# Altium schematic sheet retro_PCLD_board-V2_2026-10-05.schdoc
size 300 x 205 mm
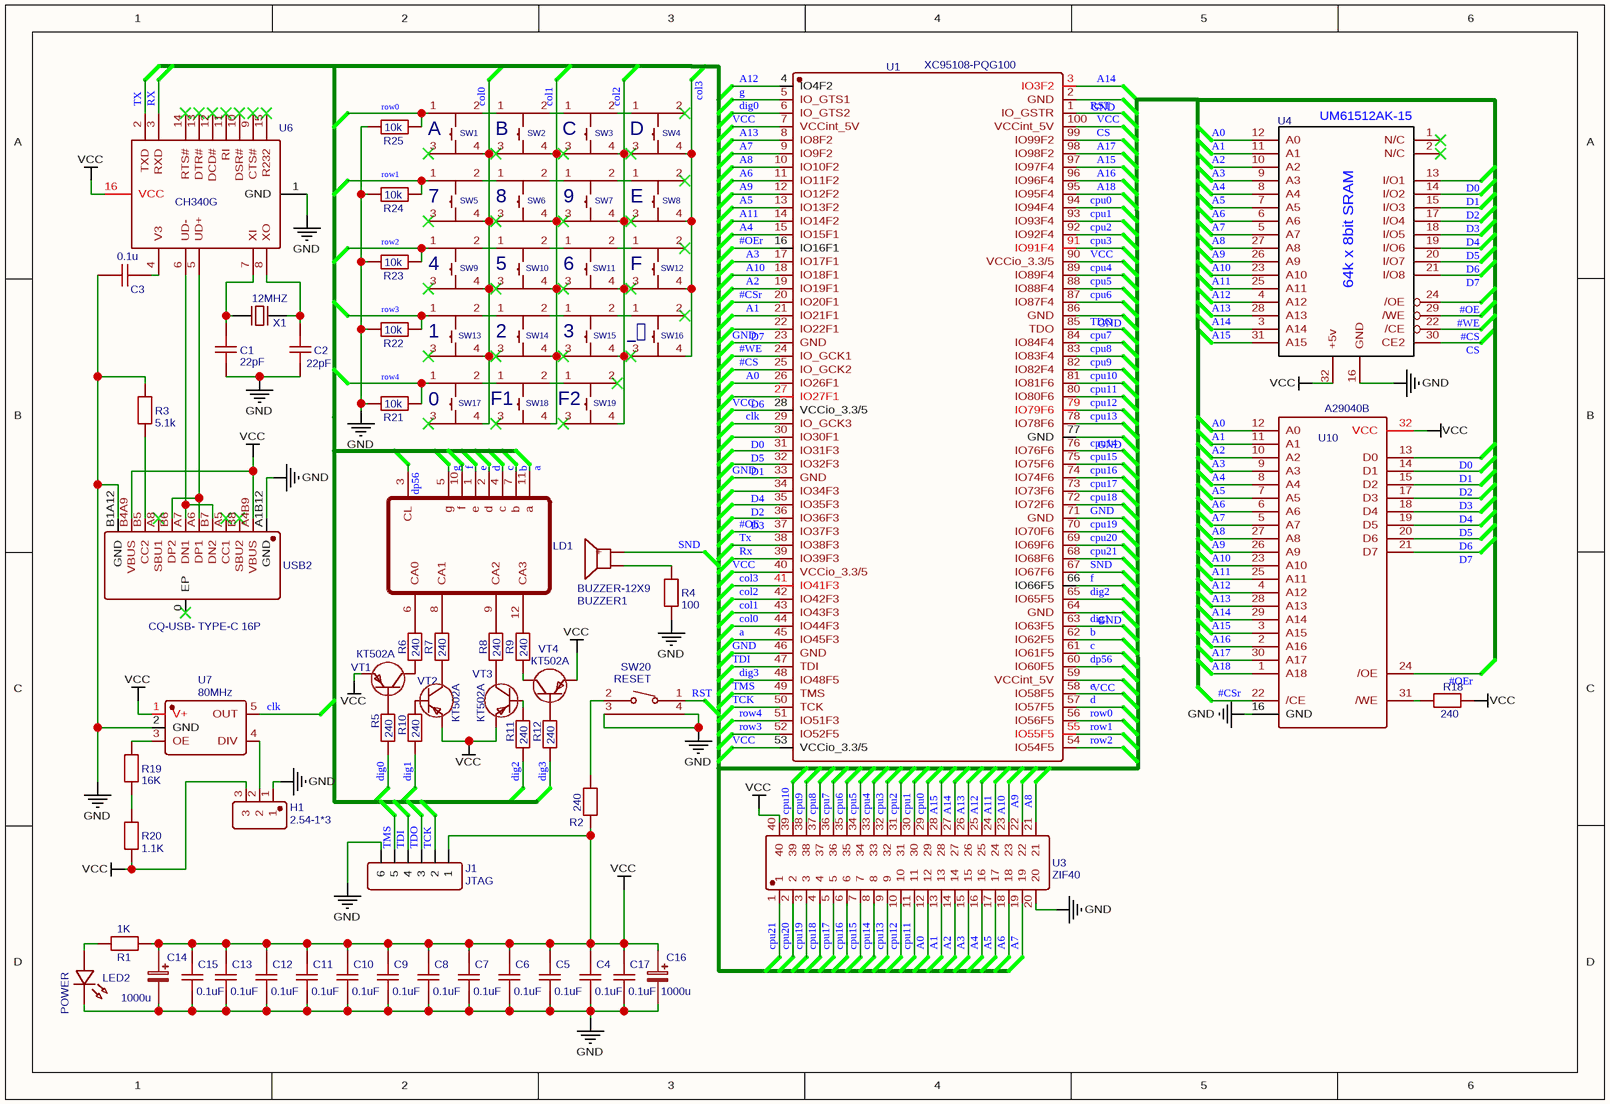
[diagram p0: retro_PCLD_board-V2_2026-10-05.schdoc]

## Parts
BUZZER1  BUZZER-12X9  [BUZ-TH_BD12.0-P7.60-D0.6-FD]
C1  22pF  [C0805]
C2  22pF  [C0805]
C3  0.1u  [C0805]
C4  0.1uF  [C0805]
C5  0.1uF  [C0805]
C6  0.1uF  [C0805]
C7  0.1uF  [C0805]
C8  0.1uF  [C0805]
C9  0.1uF  [C0805]
C10  0.1uF  [C0805]
C11  0.1uF  [C0805]
C12  0.1uF  [C0805]
C13  0.1uF  [C0805]
C14  1000u  [CAP-D6.3-F2.5]
C15  0.1uF  [C0805]
C16  1000u  [CAP-D6.3-F2.5]
C17  0.1uF  [C0805]
H1  2.54-1*3  [HDR-TH_3P-P2.54-V-M-1]
J1  JTAG  [HDR-M-2.54_1X6]
LD1  DISPLAY 14.2MM RED 4DIGIT CA  [12PIN QUAD LED DISPLAY TH100X600]  (value not drawn)
LED2  POWER  [LED-TH_BD3.0_GREEN]
R1  1K  [R0805]
R2  240  [R0805]
R3  5.1k  [R0805]
R4  100  [R0805]
R5  240  [R0805]
R6  240  [R0805]
R7  240  [R0805]
R8  240  [R0805]
R9  240  [R0805]
R10  240  [R0805]
R11  240  [R0805]
R12  240  [R0805]
R18  240  [R0805]
R19  16K  [R0805]
R20  1.1K  [R0805]
R21  10k  [R0805]
R22  10k  [R0805]
R23  10k  [R0805]
R24  10k  [R0805]
R25  10k  [R0805]
SW1  A  [B3F-1052]
SW2  B  [B3F-1052]
SW3  C  [B3F-1052]
SW4  D  [B3F-1052]
SW5  7  [B3F-1052]
SW6  8  [B3F-1052]
SW7  9  [B3F-1052]
SW8  E  [B3F-1052]
SW9  4  [B3F-1052]
SW10  5  [B3F-1052]
SW11  6  [B3F-1052]
SW12  F  [B3F-1052]
SW13  1  [B3F-1052]
SW14  2  [B3F-1052]
SW15  3  [B3F-1052]
SW16  _  [B3F-1052]
SW17  0  [B3F-1052]
SW18  F1  [B3F-1052]
SW19  F2  [B3F-1052]
SW20  RESET  [KEY-TH_OMRON_B3F-31XX]
U1  XC95108-PQG100  [MQFP-100_L20.0-W14.0-P0.65-LS24.0-BL]
U3  ZIF40  [40 PIN ZIF SOCKET]
U4  64k x 8 bit SRAM  [SKINNY-32]  (value not drawn)
U6  CH340G  [CH340G]
U7  80MHz  [TSOT-23-5_L2.9-W1.6-P0.95-LS2.8-BR]
U10  A29040B  [DIP32]
USB2  CQ-USB- TYPE-C 16P  [USB-C-SMD_CQ-USB-TYPE-C]
VT1  КТ502А  [TO-92-3_L4.9-W3.7-P1.27-L]
VT2  КТ502А  [TO-92-3_L4.9-W3.7-P1.27-L]
VT3  КТ502А  [TO-92-3_L4.9-W3.7-P1.27-L]
VT4  КТ502А  [TO-92-3_L4.9-W3.7-P1.27-L]
X1  12MHZ  [OSC-49S-1]

## Nets
GND: C1.2 C2.2 C3.2 C4.2 C5.2 C6.2 C7.2 C8.2 C9.2 C10.2 C11.2 C12.2 C13.2 C14.2 C15.2 C16.2 C17.2 H1.1 J1.6 LED2.2 R3.2 R4.1 R21.2 R22.2 R23.2 R24.2 R25.2 SW20.3 SW20.4 U1.2(GND) U1.23(GND) U1.33(GND) U1.46(GND) U1.64(GND) U1.71(GND) U1.77(GND) U1.86(GND) U3.20 U4.16(GND) U6.1(GND) U7.2(GND) U10.16(GND) USB2.A1B12(GND) USB2.B1A12(GND)
VCC: C4.1 C5.1 C6.1 C7.1 C8.1 C9.1 C10.1 C11.1 C12.1 C13.1 C14.1 C15.1 C16.1 C17.1 H1.3 J1.1 R1.1 R2.1 R18.2 R20.1 U1.7(VCCint_5V) U1.28(VCCio_3.3/5) U1.40(VCCio_3.3/5) U1.53(VCCio_3.3/5) U1.59(VCCint_5V) U1.90(VCCio_3.3/5) U1.100(VCCint_5V) U3.40 U4.32(+5v) U6.16(VCC) U7.1(V+) U10.32(VCC) USB2.A4B9(VBUS) USB2.B4A9(VBUS) VT1.1(E) VT2.1(E) VT3.1(E) VT4.1(E)
#CS: U1.25(IO_GCK2) U4.22(/CE)
#CSr: U1.20(IO20F1) U10.22(/CE)
#OE: U1.37(IO37F3) U4.24(/OE)
#OEr: U1.16(IO16F1) U10.24(/OE)
#WE: U1.24(IO_GCK1) U4.29(/WE)
a: LD1.11(a) U1.45(IO45F3)
A0: U1.26(IO26F1) U3.12 U4.12(A0) U10.12(A0)
A1: U1.21(IO21F1) U3.13 U4.11(A1) U10.11(A1)
A2: U1.19(IO19F1) U3.14 U4.10(A2) U10.10(A2)
A3: U1.17(IO17F1) U3.15 U4.9(A3) U10.9(A3)
A4: U1.15(IO15F1) U3.16 U4.8(A4) U10.8(A4)
A5: U1.13(IO13F2) U3.17 U4.7(A5) U10.7(A5)
A6: U1.11(IO11F2) U3.18 U4.6(A6) U10.6(A6)
A7: U1.9(IO9F2) U3.19 U4.5(A7) U10.5(A7)
A8: U1.10(IO10F2) U3.21 U4.27(A8) U10.27(A8)
A9: U1.12(IO12F2) U3.22 U4.26(A9) U10.26(A9)
A10: U1.18(IO18F1) U3.23 U4.23(A10) U10.23(A10)
A11: U1.14(IO14F2) U3.24 U4.25(A11) U10.25(A11)
A12: U1.4(IO4F2) U3.25 U4.4(A12) U10.4(A12)
A13: U1.8(IO8F2) U3.26 U4.28(A13) U10.28(A13)
A14: U1.3(IO3F2) U3.27 U4.3(A14) U10.29(A14)
A15: U1.97(IO97F4) U3.28 U4.31(A15) U10.3(A15)
A16: U1.96(IO96F4) U10.2(A16)
A17: U1.98(IO98F2) U10.30(A17)
A18: U1.95(IO95F4) U10.1(A18)
b: LD1.7(b) U1.62(IO62F5)
c: LD1.4(c) U1.61(IO61F5)
clk: U1.29(IO_GCK3) U7.5(OUT)
col0: SW1.4(D) SW5.4(D) SW9.4(D) SW13.4(D) SW17.4(D) U1.44(IO44F3)
col1: SW2.4(D) SW6.4(D) SW10.4(D) SW14.4(D) SW18.4(D) U1.43(IO43F3)
col2: SW3.4(D) SW7.4(D) SW11.4(D) SW15.4(D) SW19.4(D) U1.42(IO42F3)
col3: SW4.4(D) SW8.4(D) SW12.4(D) SW16.4(D) U1.41(IO41F3)
cpu0: U1.94(IO94F4) U3.29
cpu1: U1.93(IO93F4) U3.30
cpu2: U1.92(IO92F4) U3.31
cpu3: U1.91(IO91F4) U3.32
cpu4: U1.89(IO89F4) U3.33
cpu5: U1.88(IO88F4) U3.34
cpu6: U1.87(IO87F4) U3.35
cpu7: U1.84(IO84F4) U3.36
cpu8: U1.83(IO83F4) U3.37
cpu9: U1.82(IO82F4) U3.38
cpu10: U1.81(IO81F6) U3.39
cpu11: U1.80(IO80F6) U3.11
cpu12: U1.79(IO79F6) U3.10
cpu13: U1.78(IO78F6) U3.9
cpu14: U1.76(IO76F6) U3.8
cpu15: U1.75(IO75F6) U3.7
cpu16: U1.74(IO74F6) U3.6
cpu17: U1.73(IO73F6) U3.5
cpu18: U1.72(IO72F6) U3.4
cpu19: U1.70(IO70F6) U3.3
cpu20: U1.69(IO69F6) U3.2
cpu21: U1.68(IO68F6) U3.1
CS: U1.99(IO99F2) U4.30(CE2)
d: LD1.2(d) U1.57(IO57F5)
D0: U1.30(IO30F1) U4.13(I/O1) U10.13(D0)
D1: U1.32(IO32F3) U4.14(I/O2) U10.14(D1)
D2: U1.35(IO35F3) U4.15(I/O3) U10.15(D2)
D3: U1.36(IO36F3) U4.17(I/O4) U10.17(D3)
D4: U1.34(IO34F3) U4.18(I/O5) U10.18(D4)
D5: U1.31(IO31F3) U4.19(I/O6) U10.19(D5)
D6: U1.27(IO27F1) U4.20(I/O7) U10.20(D6)
D7: U1.22(IO22F1) U4.21(I/O8) U10.21(D7)
dig0: R5.1 U1.6(IO_GTS2)
dig1: R10.1 U1.63(IO63F5)
dig2: R11.1 U1.65(IO65F5)
dig3: R12.1 U1.48(IO48F5)
dp56: LD1.3(CL) U1.60(IO60F5)
e: LD1.1(e) U1.58(IO58F5)
f: LD1.10(f) U1.66(IO66F5)
g: LD1.5(g) U1.5(IO_GTS1)
row0: R25.1 SW1.1(A) U1.56(IO56F5)
row1: R24.1 SW5.1(A) U1.55(IO55F5)
row2: R23.1 SW9.1(A) U1.54(IO54F5)
row3: R22.1 SW13.1(A) U1.52(IO52F5)
row4: R21.1 SW17.1(A) U1.51(IO51F3)
RST: SW20.1 U1.1(IO_GSTR)
RX: U1.39(IO39F3) U6.3(RXD)
SND: BUZZER1.1(+) U1.67(IO67F6)
TCK: J1.2 U1.50(TCK)
TDI: J1.4 U1.47(TDI)
TDO: J1.3 U1.85(TDO)
TMS: J1.5 U1.49(TMS)
TX: U1.38(IO38F3) U6.2(TXD)
NetBUZZER1_2: BUZZER1.2 R4.2
NetC1_1: C1.1 U6.7(XI) X1.2(OSC2)
NetC2_1: C2.1 U6.8(XO) X1.1(OSC1)
NetC3_1: C3.1 U6.4(V3)
NetH1_2: H1.2 U7.4(DIV)
NetLD1_6: LD1.6(CA0) R6.2
NetLD1_8: LD1.8(CA1) R7.2
NetLD1_9: LD1.9(CA2) R8.2
NetLD1_12: LD1.12(CA3) R9.2
NetLED2_1: LED2.1 R1.2
NetR2_2: R2.2 SW20.2
NetR3_1: R3.1 USB2.B5(CC2)
NetR5_2: R5.2 VT1.2(B)
NetR6_1: R6.1 VT1.3(C)
NetR7_1: R7.1 VT2.3(C)
NetR8_1: R8.1 VT3.3(C)
NetR9_1: R9.1 VT4.3(C)
NetR10_2: R10.2 VT2.2(B)
NetR11_2: R11.2 VT3.2(B)
NetR12_2: R12.2 VT4.2(B)
NetR18_1: R18.1 U10.31(/WE)
NetR19_1: R19.1 R20.2
NetR19_2: R19.2 U7.3(OE)
NetSW1_2: SW1.2(B) SW2.1(A)
NetSW2_2: SW2.2(B) SW3.1(A)
NetSW3_2: SW3.2(B) SW4.1(A)
NetSW5_2: SW5.2(B) SW6.1(A)
NetSW6_2: SW6.2(B) SW7.1(A)
NetSW7_2: SW7.2(B) SW8.1(A)
NetSW9_2: SW9.2(B) SW10.1(A)
NetSW10_2: SW10.2(B) SW11.1(A)
NetSW11_2: SW11.2(B) SW12.1(A)
NetSW13_2: SW13.2(B) SW14.1(A)
NetSW14_2: SW14.2(B) SW15.1(A)
NetSW15_2: SW15.2(B) SW16.1(A)
NetSW17_2: SW17.2(B) SW18.1(A)
NetSW18_2: SW18.2(B) SW19.1(A)
NetU6_5: U6.5(UD+) USB2.A6(DP1) USB2.B6(DP2)
NetU6_6: U6.6(UD-) USB2.A7(DN1) USB2.B7(DN2)

Not connected (* = marked no-connect by the designer): SW1 3(C)*; SW2 3(C)*; SW3 3(C)*; SW4 2(B)* 3(C)*; SW5 3(C)*; SW6 3(C)*; SW7 3(C)*; SW8 2(B)* 3(C)*; SW9 3(C)*; SW10 3(C)*; SW11 3(C)*; SW12 2(B)* 3(C)*; SW13 3(C)*; SW14 3(C)*; SW15 3(C)*; SW16 2(B)* 3(C)*; SW17 3(C)*; SW18 3(C)*; SW19 2(B)* 3(C)*; U4 1(N/C)* 2(N/C)*; U6 9(CTS#)* 10(DSR#)* 11(RI)* 12(DCD#)* 13(DTR#)* 14(RTS#)* 15(R232)*; USB2 0(EP)* A5(CC1)* A8(SBU1)* B8(SBU2)*

## Notes on the sheet
- (in symbol 64k x 8 bit SRAM) 64k x 8bit SRAM

## Library data of the parts
BUZZER1 = BUZZER-12X9: Manufacturer: null; Contributor: lcsc; Supplier: LCSC; Supplier Part: C9900016920; Manufacturer Part: buzzer-12X9; JLCPCB Part Class: Extended Part; spicePre: B; spiceSymbolName: BUZZER-12X9
C1 C2 = 22pF: nameAlias: Value(F); Contributor: LCEDA_Lib; spicePre: C; spiceSymbolName: C_0805_US
C3 = 0.1u: nameAlias: Value(F); Contributor: LCEDA_Lib; spicePre: C; spiceSymbolName: C_0805_US
C4-C13 C15 C17 = 0.1uF: nameAlias: Value(F); Contributor: LCEDA_Lib; spicePre: C; spiceSymbolName: C_0805_US
C14 C16 = 1000u: nameAlias: Value(F); Contributor: LCEDA_Lib; spicePre: C; spiceSymbolName: CE_TH_D4.0×F1.5_EU
H1 = 2.54-1*3: Manufacturer: ZHOURI(洲日); Contributor: lcsc; Supplier: LCSC; Supplier Part: C5116482; Manufacturer Part: 2.54-1*3; JLCPCB Part Class: Extended Part; spicePre: H; spiceSymbolName: 2.54-1*3
J1 = JTAG: Contributor: LCEDA_Lib; Supplier Part: C190819; Supplier: LCSC; spicePre: J; spiceSymbolName: HDR-M-2.54_1x6
LD1 = DISPLAY 14.2MM RED 4DIGIT CA: Manufacturer: SunLED; Manufacturer Part: XDMR14A4-1A; Contributor: rppcbs; Supplier: Digi-Key; Supplier Part: 1497-1487-ND; link: https://tinyurl.com/4nnv4xw8; spicePre: L; spiceSymbolName: DISPLAY 14.2MM RED 4DIGIT CA
LED2 = POWER: Manufacturer: EVERLIGHT(台湾亿光); Manufacturer Part: 204-10SYGD/S530-E3; Contributor: LCEDA_Lib; Supplier Part: C85161; spicePre: L; spiceSymbolName: LED-TH-3mm_G
R1 = 1K: nameAlias: Value(Ω); Contributor: LCEDA_Lib; spicePre: R; spiceSymbolName: R_0805_EU
R2 R5-R12 R18 = 240: nameAlias: Value(Ω); Contributor: LCEDA_Lib; spicePre: R
  R2 R5-R12: spiceSymbolName: R_0805_EU
  R18: spiceSymbolName: R_1206_EU
R3 = 5.1k: nameAlias: Value(Ω); Contributor: LCEDA_Lib; spicePre: R; spiceSymbolName: R_0805_EU
R4 = 100: nameAlias: Value(Ω); Contributor: LCEDA_Lib; spicePre: R; spiceSymbolName: R_0805_EU
R19 = 16K: nameAlias: Value(Ω); Contributor: LCEDA_Lib; spicePre: R; spiceSymbolName: R_0805_EU
R20 = 1.1K: nameAlias: Value(Ω); Contributor: LCEDA_Lib; spicePre: R; spiceSymbolName: R_0805_EU
R21-R25 = 10k: nameAlias: Value(Ω); Contributor: LCEDA_Lib; spicePre: R; spiceSymbolName: R_0805_EU
SW1 = A: Manufacturer: Omron; Contributor: elcastrol; Supplier: Mouser; Supplier Part: B3F-1052; Manufacturer Part: B3F-1052; JLCPCB Part Class: Extended Part; link: https://www.mouser.fr/ProductDetail/Omron-Electronics/B3F-1052?qs=CX134%252BdLMDFzGB%252BRGexlIw%3D%3D; spicePre: S; spiceSymbolName: B3F-1052
SW2 = B: Manufacturer: Omron; Contributor: elcastrol; Supplier: Mouser; Supplier Part: B3F-1052; Manufacturer Part: B3F-1052; JLCPCB Part Class: Extended Part; link: https://www.mouser.fr/ProductDetail/Omron-Electronics/B3F-1052?qs=CX134%252BdLMDFzGB%252BRGexlIw%3D%3D; spicePre: S; spiceSymbolName: B3F-1052
SW3 = C: Manufacturer: Omron; Contributor: elcastrol; Supplier: Mouser; Supplier Part: B3F-1052; Manufacturer Part: B3F-1052; JLCPCB Part Class: Extended Part; link: https://www.mouser.fr/ProductDetail/Omron-Electronics/B3F-1052?qs=CX134%252BdLMDFzGB%252BRGexlIw%3D%3D; spicePre: S; spiceSymbolName: B3F-1052
SW4 = D: Manufacturer: Omron; Contributor: elcastrol; Supplier: Mouser; Supplier Part: B3F-1052; Manufacturer Part: B3F-1052; JLCPCB Part Class: Extended Part; link: https://www.mouser.fr/ProductDetail/Omron-Electronics/B3F-1052?qs=CX134%252BdLMDFzGB%252BRGexlIw%3D%3D; spicePre: S; spiceSymbolName: B3F-1052
SW5 = 7: Manufacturer: Omron; Contributor: elcastrol; Supplier: Mouser; Supplier Part: B3F-1052; Manufacturer Part: B3F-1052; JLCPCB Part Class: Extended Part; link: https://www.mouser.fr/ProductDetail/Omron-Electronics/B3F-1052?qs=CX134%252BdLMDFzGB%252BRGexlIw%3D%3D; spicePre: S; spiceSymbolName: B3F-1052
SW6 = 8: Manufacturer: Omron; Contributor: elcastrol; Supplier: Mouser; Supplier Part: B3F-1052; Manufacturer Part: B3F-1052; JLCPCB Part Class: Extended Part; link: https://www.mouser.fr/ProductDetail/Omron-Electronics/B3F-1052?qs=CX134%252BdLMDFzGB%252BRGexlIw%3D%3D; spicePre: S; spiceSymbolName: B3F-1052
SW7 = 9: Manufacturer: Omron; Contributor: elcastrol; Supplier: Mouser; Supplier Part: B3F-1052; Manufacturer Part: B3F-1052; JLCPCB Part Class: Extended Part; link: https://www.mouser.fr/ProductDetail/Omron-Electronics/B3F-1052?qs=CX134%252BdLMDFzGB%252BRGexlIw%3D%3D; spicePre: S; spiceSymbolName: B3F-1052
SW8 = E: Manufacturer: Omron; Contributor: elcastrol; Supplier: Mouser; Supplier Part: B3F-1052; Manufacturer Part: B3F-1052; JLCPCB Part Class: Extended Part; link: https://www.mouser.fr/ProductDetail/Omron-Electronics/B3F-1052?qs=CX134%252BdLMDFzGB%252BRGexlIw%3D%3D; spicePre: S; spiceSymbolName: B3F-1052
SW9 = 4: Manufacturer: Omron; Contributor: elcastrol; Supplier: Mouser; Supplier Part: B3F-1052; Manufacturer Part: B3F-1052; JLCPCB Part Class: Extended Part; link: https://www.mouser.fr/ProductDetail/Omron-Electronics/B3F-1052?qs=CX134%252BdLMDFzGB%252BRGexlIw%3D%3D; spicePre: S; spiceSymbolName: B3F-1052
SW10 = 5: Manufacturer: Omron; Contributor: elcastrol; Supplier: Mouser; Supplier Part: B3F-1052; Manufacturer Part: B3F-1052; JLCPCB Part Class: Extended Part; link: https://www.mouser.fr/ProductDetail/Omron-Electronics/B3F-1052?qs=CX134%252BdLMDFzGB%252BRGexlIw%3D%3D; spicePre: S; spiceSymbolName: B3F-1052
SW11 = 6: Manufacturer: Omron; Contributor: elcastrol; Supplier: Mouser; Supplier Part: B3F-1052; Manufacturer Part: B3F-1052; JLCPCB Part Class: Extended Part; link: https://www.mouser.fr/ProductDetail/Omron-Electronics/B3F-1052?qs=CX134%252BdLMDFzGB%252BRGexlIw%3D%3D; spicePre: S; spiceSymbolName: B3F-1052
SW12 = F: Manufacturer: Omron; Contributor: elcastrol; Supplier: Mouser; Supplier Part: B3F-1052; Manufacturer Part: B3F-1052; JLCPCB Part Class: Extended Part; link: https://www.mouser.fr/ProductDetail/Omron-Electronics/B3F-1052?qs=CX134%252BdLMDFzGB%252BRGexlIw%3D%3D; spicePre: S; spiceSymbolName: B3F-1052
SW13 = 1: Manufacturer: Omron; Contributor: elcastrol; Supplier: Mouser; Supplier Part: B3F-1052; Manufacturer Part: B3F-1052; JLCPCB Part Class: Extended Part; link: https://www.mouser.fr/ProductDetail/Omron-Electronics/B3F-1052?qs=CX134%252BdLMDFzGB%252BRGexlIw%3D%3D; spicePre: S; spiceSymbolName: B3F-1052
SW14 = 2: Manufacturer: Omron; Contributor: elcastrol; Supplier: Mouser; Supplier Part: B3F-1052; Manufacturer Part: B3F-1052; JLCPCB Part Class: Extended Part; link: https://www.mouser.fr/ProductDetail/Omron-Electronics/B3F-1052?qs=CX134%252BdLMDFzGB%252BRGexlIw%3D%3D; spicePre: S; spiceSymbolName: B3F-1052
SW15 = 3: Manufacturer: Omron; Contributor: elcastrol; Supplier: Mouser; Supplier Part: B3F-1052; Manufacturer Part: B3F-1052; JLCPCB Part Class: Extended Part; link: https://www.mouser.fr/ProductDetail/Omron-Electronics/B3F-1052?qs=CX134%252BdLMDFzGB%252BRGexlIw%3D%3D; spicePre: S; spiceSymbolName: B3F-1052
SW16 = _: Manufacturer: Omron; Contributor: elcastrol; Supplier: Mouser; Supplier Part: B3F-1052; Manufacturer Part: B3F-1052; JLCPCB Part Class: Extended Part; link: https://www.mouser.fr/ProductDetail/Omron-Electronics/B3F-1052?qs=CX134%252BdLMDFzGB%252BRGexlIw%3D%3D; spicePre: S; spiceSymbolName: B3F-1052
SW17 = 0: Manufacturer: Omron; Contributor: elcastrol; Supplier: Mouser; Supplier Part: B3F-1052; Manufacturer Part: B3F-1052; JLCPCB Part Class: Extended Part; link: https://www.mouser.fr/ProductDetail/Omron-Electronics/B3F-1052?qs=CX134%252BdLMDFzGB%252BRGexlIw%3D%3D; spicePre: S; spiceSymbolName: B3F-1052
SW18 = F1: Manufacturer: Omron; Contributor: elcastrol; Supplier: Mouser; Supplier Part: B3F-1052; Manufacturer Part: B3F-1052; JLCPCB Part Class: Extended Part; link: https://www.mouser.fr/ProductDetail/Omron-Electronics/B3F-1052?qs=CX134%252BdLMDFzGB%252BRGexlIw%3D%3D; spicePre: S; spiceSymbolName: B3F-1052
SW19 = F2: Manufacturer: Omron; Contributor: elcastrol; Supplier: Mouser; Supplier Part: B3F-1052; Manufacturer Part: B3F-1052; JLCPCB Part Class: Extended Part; link: https://www.mouser.fr/ProductDetail/Omron-Electronics/B3F-1052?qs=CX134%252BdLMDFzGB%252BRGexlIw%3D%3D; spicePre: S; spiceSymbolName: B3F-1052
SW20 = RESET: Manufacturer: OMRON(欧姆龙); Manufacturer Part: B3F-3150; Contributor: lcsc; Supplier: LCSC; Supplier Part: C2733604; JLCPCB Part Class: Extended Part; spicePre: U; spiceSymbolName: B3F-3150
U1 = XC95108-PQG100: Manufacturer: AMD/XILINX(赛灵思); Contributor: lcsc; Supplier: LCSC; Supplier Part: C3273098; Manufacturer Part: XC95108-PQG100; JLCPCB Part Class: Extended Part; spicePre: U; spiceSymbolName: XC3130-PQ100CPH
U3 = ZIF40: Manufacturer Part: New SchematicLib; Contributor: roy teddmann; Supplier: Adafruit; Supplier Part: P383B; link: http://adafru.it/383; spicePre: U; spiceSymbolName: ZIF40
U4 = 64k x 8 bit SRAM: Manufacturer: UMC; Manufacturer Part: UM61512AK-15; Contributor: DelboyJay; Supplier: Ebay; link: https://pdf1.alldatasheet.com/datasheet-pdf/view/107817/UMC/UM61512AK-15.html; spicePre: U; spiceSymbolName: UM61512AK-15 64k x 8 bit SRAM
U6 = CH340G: Contributor: lehungmt94; Supplier: Thegioiic; link: https://www.thegioiic.com/products/ch340g; spicePre: U; spiceSymbolName: CH340G
U7 = 80MHz: Manufacturer: ADI(亚德诺); Manufacturer Part: LTC6905HS5-80#TRMPBF; Contributor: LCSC; nameAlias: Value; Supplier: LCSC; Supplier Part: C689619; JLCPCB Part Class: Extended Part; spicePre: U; spiceSymbolName: LTC6905HS5-80#TRMPBF
U10 = A29040B: description: 512k by 8bits Flash; Contributor: try02695; spicePre: U; spiceSymbolName: A29040B
USB2 = CQ-USB- TYPE-C 16P: Manufacturer: null; Manufacturer Part: CQ-USB- TYPE-C 16P母座四脚插板有柱; Contributor: lcsc; Supplier: LCSC; Supplier Part: C9900026759; spicePre: U; spiceSymbolName: CQ-USB- TYPE-C 16P母座四脚插板有柱
VT1-VT4 = КТ502А: Manufacturer: MULTICOMP; Contributor: Mr Volodia; Supplier Part: 1574379; Manufacturer Part: КТ502А; Link: http://www.farnell.com/datasheets/314706.pdf?_ga=2.255308104.1194014127.1500375132-2101294022.1500196327; spicePre: V; spiceSymbolName: КТ502А
X1 = 12MHZ: Manufacturer: LCSC; Manufacturer Part: X49SD12MSD2SC; Contributor: antigoga; Value: 12MHZ; Supplier Part: undefined; Supplier: LCSC; spicePre: X; spiceSymbolName: 12MHZ